# Altium schematic sheet carDoor.SchDoc
size A4
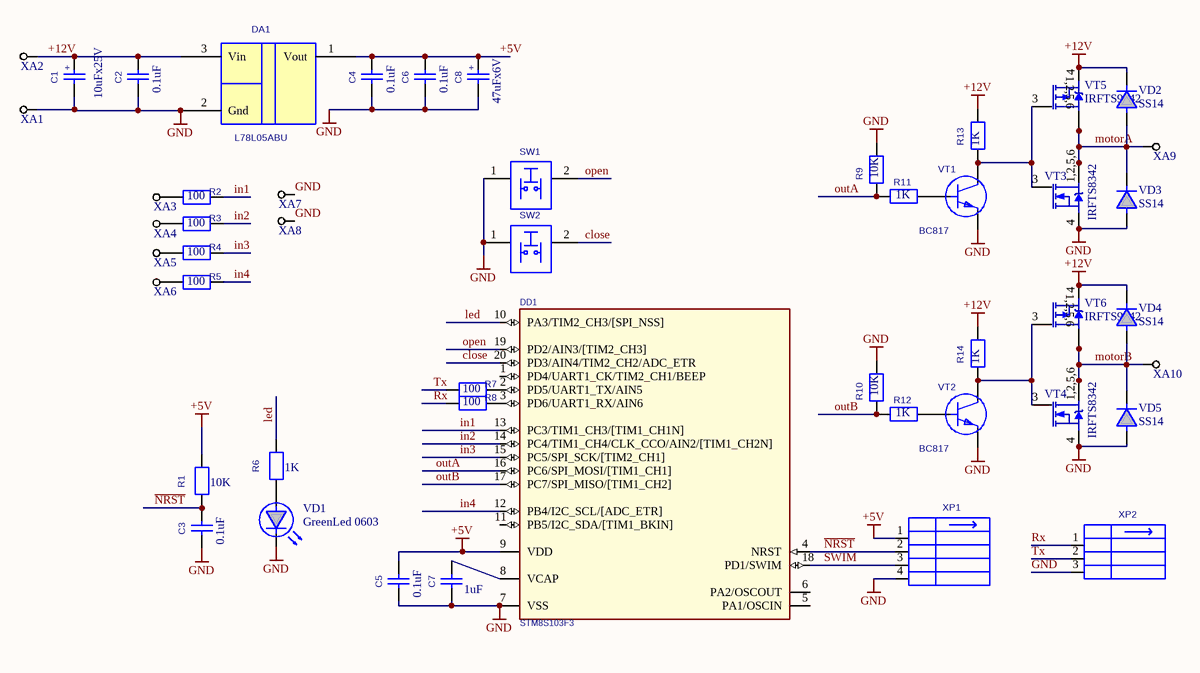
[diagram p0: carDoor.SchDoc]

## Parts
C1  10uFx25V  [C-CASE]
C2  0.1uF  [C-1608[0603]]
C3  0.1uF  [C-1608[0603]]
C4  0.1uF  [C-1608[0603]]
C5  0.1uF  [C-1608[0603]]
C6  0.1uF  [C-1608[0603]]
C7  1uF  [C-1608[0603]]
C8  47uFx6V  [C-CASE]
DA1  L78L05ABU  [SOT89]
DD1  STM8S103F3  [TSSOP20]
R1  10K  [R-1608[0603]]
R2  100  [R-1608[0603]]
R3  100  [R-1608[0603]]
R4  100  [R-1608[0603]]
R5  100  [R-1608[0603]]
R6  1K  [R-1608[0603]]
R7  100  [R-1608[0603]]
R8  100  [R-1608[0603]]
R9  10K  [R-1608[0603]]
R10  10K  [R-1608[0603]]
R11  1K  [R-1608[0603]]
R12  1K  [R-1608[0603]]
R13  1K  [R-1608[0603]]
R14  1K  [R-1608[0603]]
SW1  DTSM-32(SWT-10)  [DTSM-32(SWT-10)]  (value not drawn)
SW2  DTSM-32(SWT-10)  [DTSM-32(SWT-10)]  (value not drawn)
VD1  GreenLed 0603  [LED-0603]
VD2  SS14  [SMB]
VD3  SS14  [SMB]
VD4  SS14  [SMB]
VD5  SS14  [SMB]
VT1  BC817  [SOT-23]
VT2  BC817  [SOT-23]
VT3  IRFTS8342  [Micro6]
VT4  IRFTS8342  [Micro6]
VT5  IRFTS9342  [Micro6]
VT6  IRFTS9342  [Micro6]
XA1  *  [TPad-4x2mm]  (value not drawn)
XA2  *  [TPad-4x2mm]  (value not drawn)
XA3  *  [TPad-3x1.5mm]  (value not drawn)
XA4  *  [TPad-3x1.5mm]  (value not drawn)
XA5  *  [TPad-3x1.5mm]  (value not drawn)
XA6  *  [TPad-3x1.5mm]  (value not drawn)
XA7  *  [TPad-3x1.5mm]  (value not drawn)
XA8  *  [TPad-3x1.5mm]  (value not drawn)
XA9  *  [TPad-4x2mm]  (value not drawn)
XA10  *  [TPad-4x2mm]  (value not drawn)
XP1  PLS-4  [PLS4]  (value not drawn)
XP2  PLS-3  [PLS3]  (value not drawn)

## Nets
+5V: C4.1 C5.1 C6.1 C8.1(+) DA1.1(Vout) DD1.9(VDD) R1.2 XP1.1
+12V: C1.1(+) C2.1 DA1.3(Vin) R13.2 R14.2 VD2.1(K) VD4.1(K) VT5.4(S) VT6.4(S) XA2.0
GND: C1.2(-) C2.2 C3.2 C4.2 C5.2 C6.2 C7.2 C8.2(-) DA1.2(Gnd) DD1.7(VSS) R9.2 R10.2 SW1.1(pin1) SW2.1(pin1) VD1.1(K) VD3.2(A) VD5.2(A) VT1.2(E) VT2.2(E) VT3.4(S) VT4.4(S) XA1.0 XA7.0 XA8.0 XP1.4 XP2.3
close: DD1.20(PD3/AIN4/TIM2_CH2/ADC_ETR) SW2.2(pin3)
in1: DD1.13(PC3/TIM1_CH3/[TIM1_CH1N]) R2.2
in2: DD1.14(PC4/TIM1_CH4/CLK_CCO/AIN2/[TIM1_CH2N]) R3.2
in3: DD1.15(PC5/SPI_SCK/[TIM2_CH1]) R4.2
in4: DD1.12(PB4/I2C_SCL/[ADC_ETR]) R5.2
led: DD1.10(PA3/TIM2_CH3/[SPI_NSS]) R6.2
motorA: VD2.2(A) VD3.1(K) VT3.1(D) VT3.2(D) VT3.5(D) VT3.6(D) VT5.1(D) VT5.2(D) VT5.5(D) VT5.6(D) XA9.0
motorB: VD4.2(A) VD5.1(K) VT4.1(D) VT4.2(D) VT4.5(D) VT4.6(D) VT6.1(D) VT6.2(D) VT6.5(D) VT6.6(D) XA10.0
~{NRST}: C3.1 DD1.4(NRST) R1.1 XP1.2
open: DD1.19(PD2/AIN3/[TIM2_CH3]) SW1.2(pin3)
outA: DD1.16(PC6/SPI_MOSI/[TIM1_CH1]) R9.1 R11.1
outB: DD1.17(PC7/SPI_MISO/[TIM1_CH2]) R10.1 R12.1
Rx: R8.1 XP2.1
SWIM: DD1.18(PD1/SWIM) XP1.3
Tx: R7.1 XP2.2
NetC7_1: C7.1 DD1.8(VCAP)
NetDD1_2: DD1.2(PD5/UART1_TX/AIN5) R7.2
NetDD1_3: DD1.3(PD6/UART1_RX/AIN6) R8.2
NetR2_1: R2.1 XA3.0
NetR3_1: R3.1 XA4.0
NetR4_1: R4.1 XA5.0
NetR5_1: R5.1 XA6.0
NetR6_1: R6.1 VD1.2(A)
NetR11_2: R11.2 VT1.1(B)
NetR12_2: R12.2 VT2.1(B)
NetR13_1: R13.1 VT1.3(C) VT3.3(G) VT5.3(G)
NetR14_1: R14.1 VT2.3(C) VT4.3(G) VT6.3(G)

Not connected (* = marked no-connect by the designer): DD1 1(PD4/UART1_CK/TIM2_CH1/BEEP) 5(PA1/OSCIN) 6(PA2/OSCOUT) 11(PB5/I2C_SDA/[TIM1_BKIN])

## Notes on the sheet
- (in symbol IRFTS8342) 1,2,5,6
- (in symbol IRFTS9342) 1,2,5,6

## Library data of the parts
C1 C8 = C-CCASE
  C1: Value: 10uFx25V
  C8: Value: 47uFx6V
C2-C7 = C-0603
  C2-C6: Value: 0.1uF
  C7: Value: 1uF
DD1 = STM8S103Fx TSSOP20, SO20: STM8 8-bit microcontroller
R1-R14 = R-0603
  R1 R9 R10: Value: 10K
  R2-R5 R7 R8: Value: 100
  R6 R11-R14: Value: 1K
VD1 = L-C191KGCT: 0603 Green Led
VD2-VD5 = MBRS140T3G: Surface Mount Schottky Power Rectifier
VT3 VT4 = IRFTS8342: HEXFET Power Mosfet N channel
VT5 VT6 = IRFTS9342: HEXFET Power MOSFET P channel
XA1-XA10 = TPad without via: pad for soldering; Value: *
XP1 = PLS-4: Value: {Value}
XP2 = PLS-3: Value: {Value}
DA1 = L78L05ABU: Value: *
SW1 SW2 = DTSM-32(SWT-10): Value: *
VT1 VT2 = BC817: Value: *